# EAGLE design nolleblink2009_final (EAGLE 5.04)
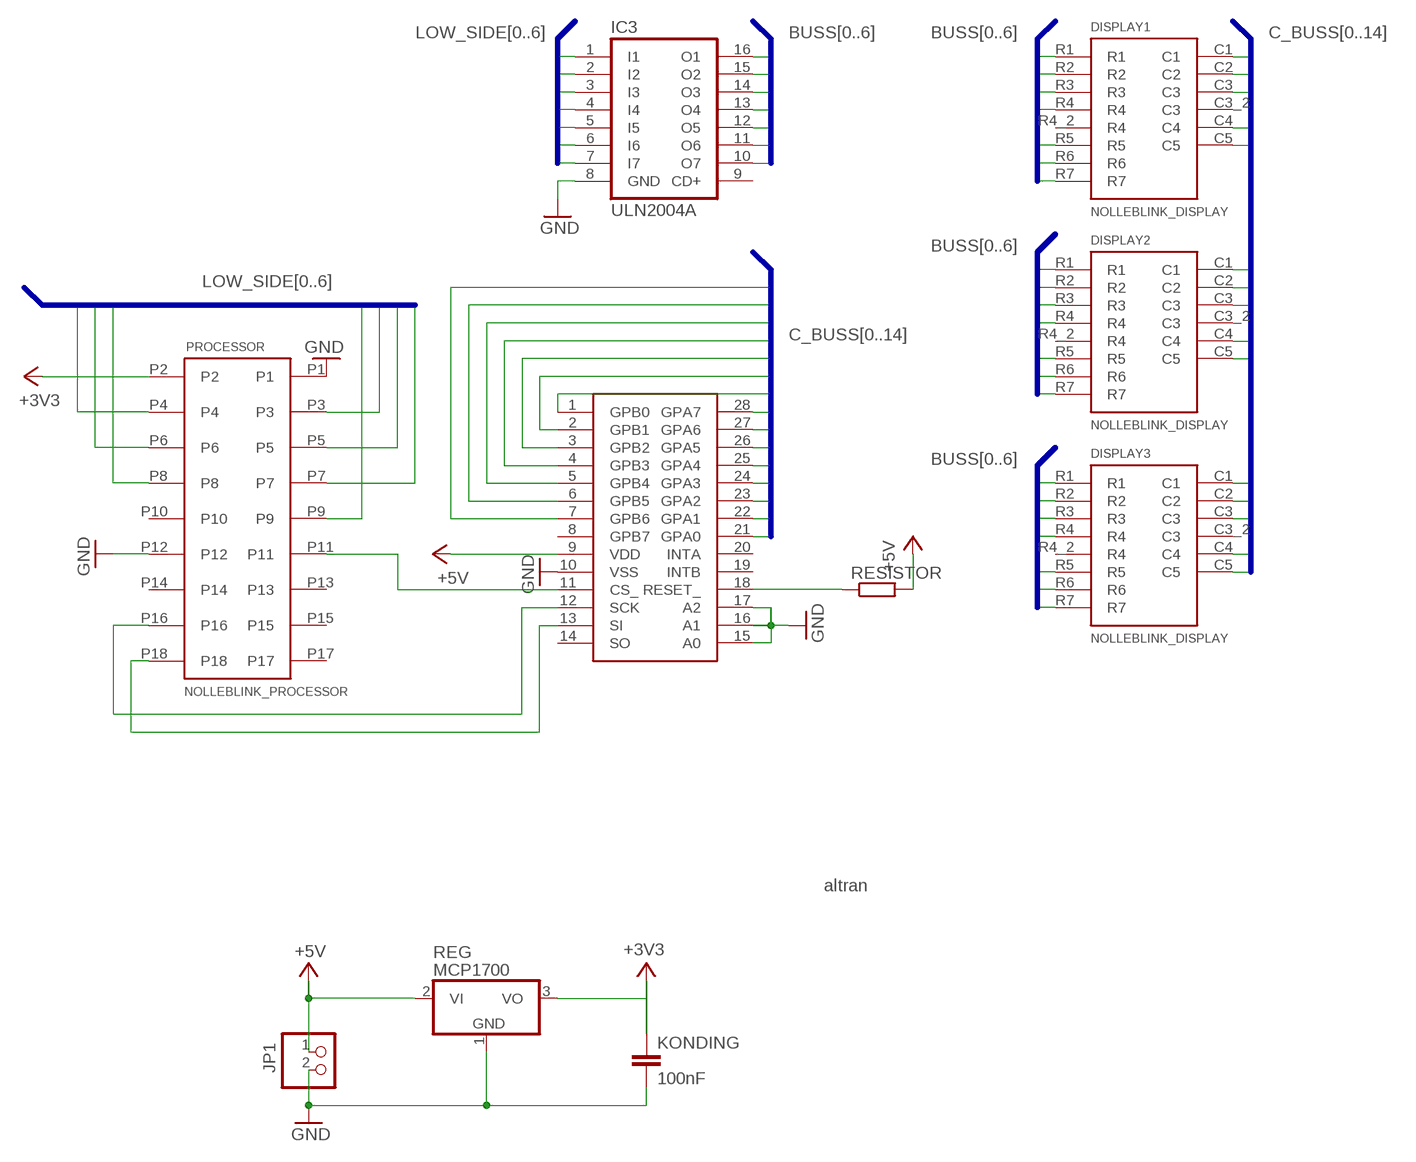
[diagram p0: schematic, sheet 1]

## Parts
DISPLAY1  NOLLEBLINK_DISPLAY  [KINGBRIGHT_TA12-11EWA]
DISPLAY2  NOLLEBLINK_DISPLAY  [KINGBRIGHT_TA12-11EWA]
DISPLAY3  NOLLEBLINK_DISPLAY  [KINGBRIGHT_TA12-11EWA]
IC2  MCPS23S17  [MCP23S17]
IC3  ULN2004A  ULN2004AN  [DIL16]
JP1  PINHD-1X2  [1X02]
KONDING  100nF  C-EU050-030X075  [C050-030X075]
PROCESSOR  NOLLEBLINK_PROCESSOR  [CON_18_NOLLEBLINK]
REG  MCP1700  MCP_REGULATOR  [TO92_REGULATOR]
RESISTOR  R-EU_0207/10  [0207/10]
U$1  ALTRAN  [ALTRAN]

## Nets
+3V3: KONDING.1 PROCESSOR.P2 REG.3(VO)
+5V: IC2.9(VDD) JP1.1 REG.2(VI) RESISTOR.2
BUSS0: DISPLAY1.R1 DISPLAY2.R1 DISPLAY3.R1 IC3.16(O1)
BUSS1: DISPLAY1.R2 DISPLAY2.R2 DISPLAY3.R2 IC3.15(O2)
BUSS2: DISPLAY1.R3 DISPLAY2.R3 DISPLAY3.R3 IC3.14(O3)
BUSS3: DISPLAY1.R4 DISPLAY2.R4 DISPLAY3.R4 IC3.13(O4)
BUSS4: DISPLAY1.R5 DISPLAY2.R5 DISPLAY3.R5 IC3.12(O5)
BUSS5: DISPLAY1.R6 DISPLAY2.R6 DISPLAY3.R6 IC3.11(O6)
BUSS6: DISPLAY1.R7 DISPLAY2.R7 DISPLAY3.R7 IC3.10(O7)
C_BUSS0: DISPLAY1.C1 IC2.21(GPA0)
C_BUSS1: DISPLAY1.C2 IC2.22(GPA1)
C_BUSS2: DISPLAY1.C3 IC2.23(GPA2)
C_BUSS3: DISPLAY1.C4 IC2.24(GPA3)
C_BUSS4: DISPLAY1.C5 IC2.25(GPA4)
C_BUSS5: DISPLAY2.C1 IC2.26(GPA5)
C_BUSS6: DISPLAY2.C2 IC2.27(GPA6)
C_BUSS7: DISPLAY2.C3 IC2.28(GPA7)
C_BUSS8: DISPLAY2.C4 IC2.1(GPB0)
C_BUSS9: DISPLAY2.C5 IC2.2(GPB1)
C_BUSS10: DISPLAY3.C1 IC2.3(GPB2)
C_BUSS11: DISPLAY3.C2 IC2.4(GPB3)
C_BUSS12: DISPLAY3.C3 IC2.5(GPB4)
C_BUSS13: DISPLAY3.C4 IC2.6(GPB5)
C_BUSS14: DISPLAY3.C5 IC2.7(GPB6)
GND: IC2.10(VSS) IC2.15(A0) IC2.16(A1) IC2.17(A2) IC3.8(GND) JP1.2 KONDING.2 PROCESSOR.P1 PROCESSOR.P12 REG.1(GND)
LOW_SIDE0: IC3.7(I7) PROCESSOR.P3
LOW_SIDE1: IC3.6(I6) PROCESSOR.P4
LOW_SIDE2: IC3.5(I5) PROCESSOR.P5
LOW_SIDE3: IC3.4(I4) PROCESSOR.P6
LOW_SIDE4: IC3.3(I3) PROCESSOR.P7
LOW_SIDE5: IC3.2(I2) PROCESSOR.P8
LOW_SIDE6: IC3.1(I1) PROCESSOR.P9
N$1: IC2.11(CS_) PROCESSOR.P11
N$2: IC2.13(SI) PROCESSOR.P18
N$3: IC2.12(SCK) PROCESSOR.P16
N$4: IC2.18(RESET_) RESISTOR.1
Unconnected: DISPLAY1.C3_2(C3) DISPLAY1.R4_2(R4) DISPLAY2.C3_2(C3) DISPLAY2.R4_2(R4) DISPLAY3.C3_2(C3) DISPLAY3.R4_2(R4) IC2.8(GPB7) IC2.14(SO) IC2.19(INTB) IC2.20(INTA) IC3.9(CD+) PROCESSOR.P10 PROCESSOR.P13 PROCESSOR.P14 PROCESSOR.P15 PROCESSOR.P17

## Buses
BUSS[0..6]
LOW_SIDE[0..6]
C_BUSS[0..14]

## Library data of the parts
DISPLAY1-DISPLAY3 = stefan:NOLLEBLINK_DISPLAY: Nolleblinkmojt Display 2009 www.etf.nu
IC2 = microchip2:MCPS23S17
IC3 = uln-udn:ULN2004A: DRIVER ARRAY
JP1 = pinhead:PINHD-1X2: PIN HEADER
KONDING = rcl:C-EU: CAPACITOR, European symbol
PROCESSOR = stefan:NOLLEBLINK_PROCESSOR: Texas Instruments Development Board Nolleblinkmojt 2009 www.etf.nu
REG = ag:MCP_REGULATOR
RESISTOR = rcl:R-EU_: RESISTOR, European symbol
U$1 = mine:ALTRAN

## Board
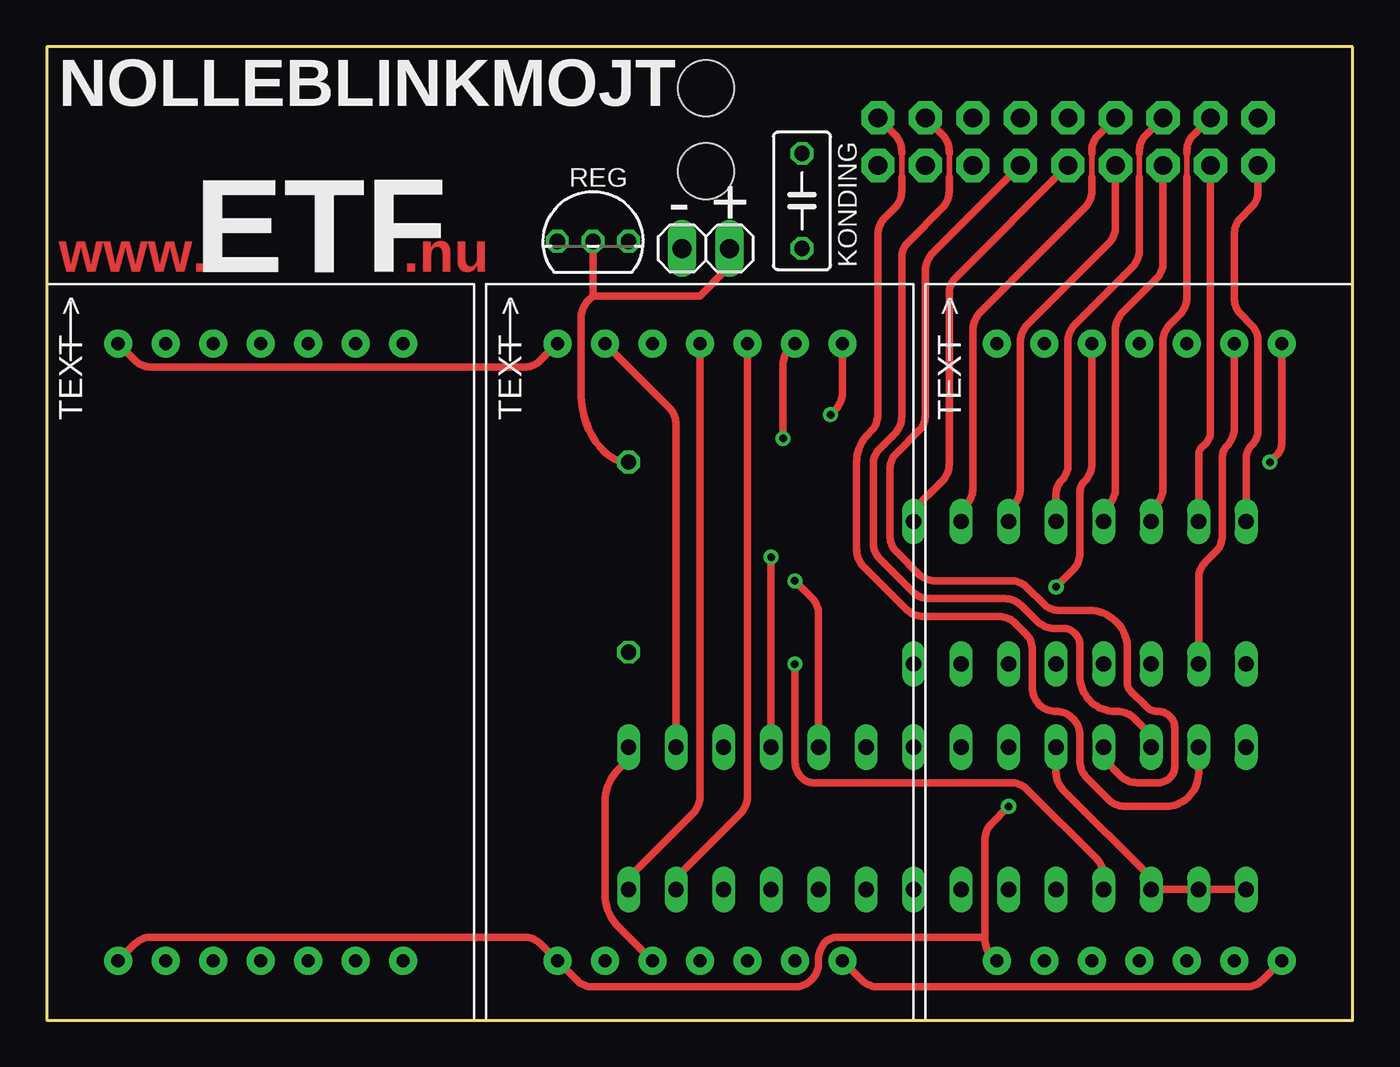
[diagram p1: board, top side]
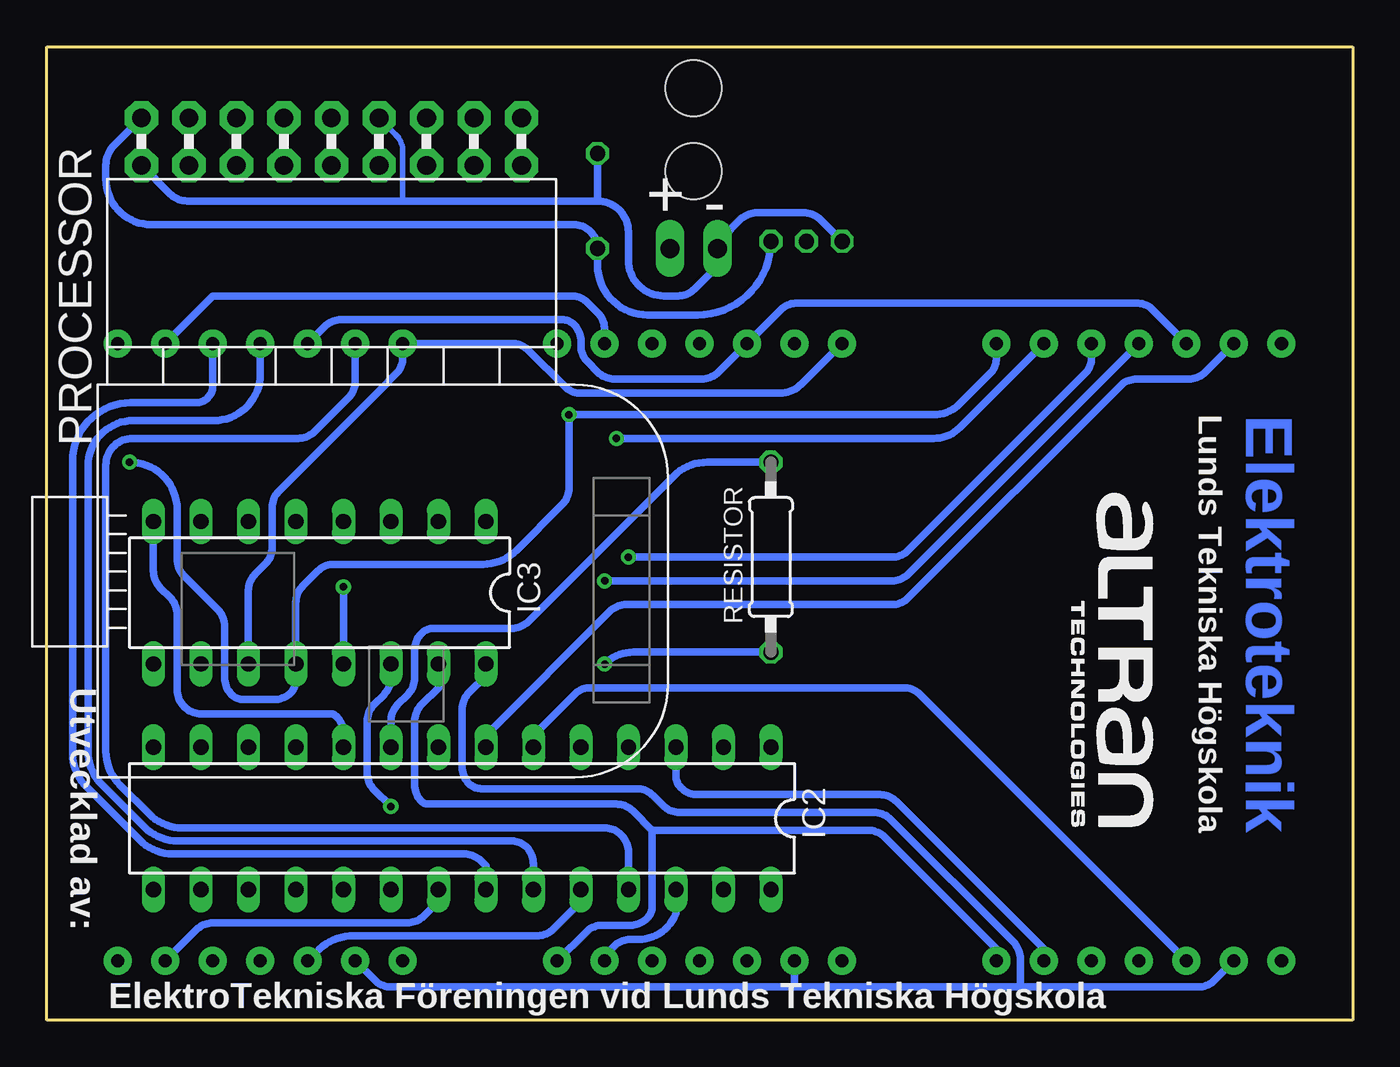
[diagram p2: board, bottom side, seen from below]

Size 69.84 x 52.06 mm. Coordinates in mm from the lower left corner, seen from the top.
Outline: 0,0 69.84,0 69.84,52.06 0,52.06 0,0
Copper layers (1*16): Top 0.0356mm / dielectric 1.5mm / Bottom 0.0356mm
Design rules "pcb_cart_standard (by skoog)": minimum track width 0.2007mm, minimum drill 0.0102mm, track to track 0.2007mm, track to pad 0.2007mm, pad to pad 0.2007mm, via to via 0.2007mm, smd to smd 16mil, copper to edge 0.2007mm, drill to drill 0.2007mm, minimum pad ring 0.2007mm, minimum via ring 8mil, stop-mask expansion 0mil, vias tented up to drill 0mil, thermal gap 0.2007mm
Holes 3 mm at 35.24,49.85 35.24,45.4

### Footprints (pad centres in the part's own frame; a part is rotated, then mirrored left to right if it is on the bottom)
KINGBRIGHT_TA12-11EWA = drill 0.7 pad 1.5 round: C1 5.08,-16.51; C2 2.54,16.51; C3 0,16.51; C3_2 0,-16.51; C4 -2.54,-16.51; C5 -5.08,16.51; R1 -5.08,-16.51; R2 7.62,-16.51; R3 -7.62,-16.51; R4 -2.54,16.51; R4_2 2.54,-16.51; R5 7.62,16.51; R6 -7.62,16.51; R7 5.08,16.51
MCP23S17 = drill 0.813 long: 1 -12.7,-3.81; 2 -10.16,-3.81; 3 -7.62,-3.81; 4 -5.08,-3.81; 5 -2.54,-3.81; 6 0,-3.81; 7 2.54,-3.81; 8 5.08,-3.81; 9 7.62,-3.81; 10 10.16,-3.81; 11 12.7,-3.81; 12 15.24,-3.81; 13 17.78,-3.81; 14 20.32,-3.81; 15 20.32,3.81; 16 17.78,3.81; 17 15.24,3.81; 18 12.7,3.81; 19 10.16,3.81; 20 7.62,3.81; 21 5.08,3.81; 22 2.54,3.81; 23 0,3.81; 24 -2.54,3.81; 25 -5.08,3.81; 26 -7.62,3.81; 27 -10.16,3.81; 28 -12.7,3.81
DIL16 = drill 0.813 long: 1 -8.89,-3.81; 2 -6.35,-3.81; 3 -3.81,-3.81; 4 -1.27,-3.81; 5 1.27,-3.81; 6 3.81,-3.81; 7 6.35,-3.81; 8 8.89,-3.81; 9 8.89,3.81; 10 6.35,3.81; 11 3.81,3.81; 12 1.27,3.81; 13 -1.27,3.81; 14 -3.81,3.81; 15 -6.35,3.81; 16 -8.89,3.81
1X02 = drill 1.016 long: 1 -1.27,0; 2 1.27,0
C050-030X075 = drill 0.813 octagon: 1 -2.54,0; 2 2.54,0
CON_18_NOLLEBLINK = drill 1 pad 1.778 octagon: P1 10.16,1.27; P2 10.16,-1.27; P3 7.62,1.27; P4 7.62,-1.27; P5 5.08,1.27; P6 5.08,-1.27; P7 2.54,1.27; P8 2.54,-1.27; P9 0,1.27; P10 0,-1.27; P11 -2.54,1.27; P12 -2.54,-1.27; P13 -5.08,1.27; P14 -5.08,-1.27; P15 -7.62,1.27; P16 -7.62,-1.27; P17 -10.16,1.27; P18 -10.16,-1.27
TO92_REGULATOR = drill 0.813 octagon: 1 -1.905,0; 2 0,0; 3 1.905,0
0207/10 = drill 0.813 octagon: 1 -5.08,0; 2 5.08,0

### Placement (x,y rotation side)
DISPLAY1  58.42,19.68 0 top
DISPLAY2  34.92,19.68 0 top
DISPLAY3  11.43,19.68 0 top
IC2  43.81,10.79 180 bottom
IC3  55.24,22.86 180 bottom
JP1  35.24,41.27 180 top
KONDING  40.39,43.81 90 top
PROCESSOR  54.61,46.99 180 bottom
REG  29.21,41.66 0 top
RESISTOR  31.11,24.77 90 bottom
U$1  17.97,6.97 90 top

### Tracks (layer width: path | path; a pad name or v marks a point on that pad's centre or on a via)
+3V3
  Bottom 0.305: 65.4,47.63 PROCESSOR.P2 | 64.14,42.55 64.24,42.55
  Bottom 0.406: REG.3 arc90 35.05,37.72 37.71,37.72 arc90 40.39,40.39 KONDING.1 arc-90 41.66,42.55 64.14,42.55 | 64.24,42.55 arc90 66.67,44.98 66.67,45.72 arc45 66.23,46.8 65.4,47.63
+5V
  Top 0.406: 34.92,38.73 36.2,40.01 36.2,40.96 JP1.1 36.51,40.32 34.92,38.73 | 29.21,38.73 34.92,38.73 | 29.21,38.73 REG.2 | 29.21,38.73 28.95,38.47 arc45 28.57,37.57 28.57,33.44 arc45 29.84,30.37 arc45 RESISTOR.2
  Bottom 0.406: IC2.9 51.44,15.98 arc45 51.06,16.88 50.54,17.41 arc-45 50.16,18.31 50.16,19.79 arc45 49.79,20.69 arc45 49.16,20.95 44.98,20.95 arc-45 44.08,21.33 36.3,29.1 arc45 34.51,29.84 RESISTOR.2
BUSS0
  Bottom 0.406: IC3.16 46.35,18.41 47.25,17.52 arc-45 47.62,16.62 47.62,13.54 arc-45 47.25,12.65 arc-45 46.62,12.38 38.31,12.38 arc45 37.41,12.01 36.88,11.48 arc-45 35.99,11.11 25.61,11.11 arc45 24.71,10.74 18.15,4.18 arc45 17.78,3.28 17.78,1.78 | 17.78,1.78 29.84,1.78 | 29.84,1.78 DISPLAY2.R1 | 29.84,1.78 51.42,1.78 arc45 52.31,2.15 DISPLAY1.R1 | 17.78,1.78 8.27,1.78 arc-45 7.38,2.15 DISPLAY3.R1
BUSS1
  Top 0.406: DISPLAY2.R2 43.57,2.15 arc45 44.47,1.78 64.12,1.78 arc45 65.02,2.15 DISPLAY1.R2
  Bottom 0.406: IC3.15 48.9,17.78 49.79,16.88 arc-45 50.16,15.98 50.16,12.59 arc-45 49.79,11.69 arc-45 49.47,11.56 39.39,11.56 arc45 38.49,11.19 37.47,10.16 | 37.47,10.16 37.47,6.09 arc45 37.73,5.45 arc45 38.63,5.08 40.11,5.08 arc-45 41.01,4.71 DISPLAY2.R2 | DISPLAY3.R2 19.05,3.81 25.03,9.79 arc-45 25.93,10.16 37.47,10.16
BUSS2  (via drill 0.4)
  Top 0.406: 50.16,4.45 50.16,9.63 arc-45 50.54,10.53 v51.44,11.43 | 50.16,4.45 50.16,4.34 arc45 50.54,3.44 DISPLAY1.R3 | DISPLAY3.R3 4.71,4.07 arc-45 5.61,4.45 25.51,4.45 arc-45 26.41,4.07 DISPLAY2.R3 28.33,2.15 arc45 29.23,1.78 39.99,1.78 arc45 40.88,2.15 40.9,2.17 arc45 41.27,3.07 41.27,3.28 arc-45 41.65,4.18 arc-45 42.28,4.45 50.16,4.45
  Bottom 0.406: v51.44,11.43 52.33,12.33 arc45 52.7,13.23 52.7,15.98 arc45 52.33,16.88 51.81,17.41 arc-45 51.44,18.31 IC3.14
BUSS3  (via drill 0.4)
  Top 0.406: v53.98,23.18 54.87,24.08 arc45 55.24,24.97 55.24,28.2 arc-45 55.51,28.84 arc45 55.88,29.74 DISPLAY1.R4
  Bottom 0.406: v53.98,23.18 IC3.13 | DISPLAY3.R4 10.68,37.98 arc-45 11.57,38.35 29.7,38.35 arc-45 30.6,37.98 DISPLAY2.R4 33.92,34.66 arc45 34.82,34.29 39.48,34.29 arc45 40.38,34.66 40.9,35.19 arc45 41.27,36.09 41.27,36.3 arc-45 41.65,37.2 arc-45 42.28,37.47 54.08,37.47 arc-45 54.98,37.09 DISPLAY1.R4
BUSS4  (via drill 0.4)
  Top 0.406: v65.41,29.84 65.78,30.22 arc45 66.04,30.85 DISPLAY1.R5 | v41.91,32.38 42.17,32.65 arc45 42.55,33.55 DISPLAY2.R5
  Bottom 0.406: DISPLAY3.R5 19.05,35.45 arc45 19.42,34.55 21,32.97 arc45 22.42,32.38 v41.91,32.38 41.91,28.47 arc45 42.28,27.57 44.72,25.13 arc45 46.52,24.38 54.47,24.38 arc-45 55.36,24.01 56.14,23.23 arc-45 56.52,22.33 IC3.12 56.52,18.15 arc45 56.78,17.52 arc45 57.68,17.14 59.32,17.14 arc45 59.95,17.41 arc45 60.33,18.31 60.33,21.06 arc-45 60.7,21.96 62.49,23.76 arc45 62.87,24.66 62.87,27.3 arc-90 v65.41,29.84
BUSS5
  Top 0.406: DISPLAY3.R6 4.71,35.3 arc45 5.61,34.92 25.51,34.92 arc45 26.41,35.3 DISPLAY2.R6
  Bottom 0.406: IC3.11 59.05,22.97 arc45 58.68,23.87 58.16,24.39 arc-45 57.78,25.29 57.78,27.41 arc45 57.41,28.31 52.07,33.66 51.17,34.55 arc-45 50.8,35.45 DISPLAY1.R6 44.98,36.2 arc45 44.08,35.82 42.16,33.9 arc-45 41.26,33.53 30.62,33.53 arc-45 29.47,34.03 DISPLAY2.R6
BUSS6  (via drill 0.4)
  Top 0.406: DISPLAY1.R7 63.5,31.64 arc-45 63.13,30.74 arc45 62.87,30.11 62.87,25.93 arc-45 62.49,25.03 61.97,24.5 arc45 61.59,23.6 IC3.10 | v39.37,31.11 39.37,35.03 arc-45 39.74,35.93 DISPLAY2.R7
  Bottom 0.406: DISPLAY1.R7 60.96,38.73 41.8,38.73 arc45 40.9,38.36 40.38,37.84 arc45 40.01,36.94 DISPLAY2.R7 | DISPLAY3.R7 21,31.7 arc45 22.42,31.11 v39.37,31.11
C_BUSS0
  Bottom 0.406: IC2.21 48.9,6.35 49.67,5.58 arc45 50.56,5.21 60.94,5.21 arc-45 61.84,4.83 DISPLAY1.C1
C_BUSS1
  Bottom 0.406: IC2.22 46.35,8.26 46.62,8.52 arc-45 47.52,8.89 63.08,8.89 arc45 64.88,9.63 67.71,12.46 arc45 68.45,14.26 68.45,29.92 arc90 65.35,33.02 61.86,33.02 arc-90 60.96,33.92 DISPLAY1.C2
C_BUSS2
  Bottom 0.406: IC2.23 43.81,8.36 arc-45 44.19,9.26 arc-45 44.98,9.59 62.83,9.59 arc45 64.62,10.33 66.88,12.59 arc45 67.63,14.39 67.63,29.65 arc90 65.21,32.07 60.9,32.07 arc-90 58.42,34.55 DISPLAY1.C3
C_BUSS3
  Bottom 0.406: IC2.24 41.27,6.35 42.74,4.88 arc45 43.64,4.51 53.62,4.51 arc-45 55.42,3.64 DISPLAY1.C4
C_BUSS4
  Bottom 0.406: IC2.25 38.73,9 arc-45 39.11,9.9 39.12,9.91 arc-45 40.02,10.29 62.58,10.29 arc45 64.37,11.03 65.93,12.59 arc45 66.67,14.39 66.67,29.7 arc90 65.25,31.11 56.41,31.11 arc-45 55.51,31.49 53.71,33.28 arc-45 53.34,34.18 DISPLAY1.C5
C_BUSS5
  Bottom 0.406: IC2.26 36.2,5.71 36.22,5.65 arc68 38.21,4.32 38.6,4.32 arc-61 39.74,3.65 DISPLAY2.C1
C_BUSS6
  Top 0.406: IC2.27 33.66,7.62 37.09,11.06 arc45 37.47,11.96 DISPLAY2.C2
C_BUSS7
  Top 0.406: IC2.28 31.11,7.62 34.55,11.06 arc45 34.92,11.96 DISPLAY2.C3
C_BUSS8
  Top 0.406: DISPLAY2.C4 30.59,4.97 arc-45 29.84,6.77 29.84,11.65 arc-45 30.59,13.44 31.11,13.97 IC2.1
C_BUSS9
  Top 0.406: IC2.2 33.66,31.86 arc45 33.28,32.76 DISPLAY2.C5
C_BUSS10
  Bottom 0.406: IC2.3 36.2,13.07 arc-45 35.93,12.44 arc-45 35.03,12.06 25.29,12.06 arc45 24.39,11.69 16.51,3.81 DISPLAY3.C1
C_BUSS11  (via drill 0.4)
  Top 0.406: v38.73,24.77 IC2.4
  Bottom 0.406: DISPLAY3.C2 13.97,35.45 arc45 14.34,34.55 23.76,25.14 arc45 24.66,24.77 v38.73,24.77
C_BUSS12  (via drill 0.4)
  Top 0.406: v40.01,23.5 40.9,22.6 arc-45 41.27,21.7 IC2.5
  Bottom 0.406: DISPLAY3.C3 23.76,23.87 arc45 24.66,23.5 v40.01,23.5
C_BUSS13
  Bottom 0.406: IC2.6 43.81,15.24 41.65,17.41 arc45 40.75,17.78 24.02,17.78 arc45 23.12,17.41 DISPLAY3.C4
C_BUSS14
  Bottom 0.406: IC2.7 46.35,15.24 39.74,21.85 arc45 38.84,22.23 24.66,22.23 arc-45 23.76,22.6 12.44,33.92 arc45 11.54,34.29 8.78,34.29 arc-45 7.88,34.66 DISPLAY3.C5
GND
  Top 0.406: IC3.8 64.14,29.95 arc-45 64.51,30.85 arc45 64.77,31.49 64.77,36.3 arc45 64.4,37.2 63.87,37.73 arc-45 63.5,38.63 63.5,42.02 arc-45 63.87,42.92 64.4,43.44 arc45 64.77,44.34 PROCESSOR.P1 | IC2.15 IC2.16 IC2.17 59.05,7.62 54.35,12.33 arc-45 53.98,13.23 IC2.10
  Bottom 0.305: 50.8,43.81 50.8,46.46 arc-45 51.17,47.36 PROCESSOR.P12
  Bottom 0.406: IC2.10 53.98,15.35 arc-45 54.35,16.25 arc-45 54.67,16.38 61.58,16.38 arc45 62.48,16.75 62.49,16.77 arc45 62.87,17.67 62.87,21.7 arc-45 63.24,22.6 63.76,23.12 arc45 64.14,24.02 IC3.8 | PROCESSOR.P1 63.24,44.19 arc-45 62.34,43.81 50.8,43.81 40.39,43.81 | 27,41.53 arc45 REG.1 28.44,42.79 arc-45 29.38,43.18 31.86,43.18 arc-45 32.76,42.81 33.66,41.91 33.66,41.59 JP1.2 33.97,40.32 35.19,39.11 arc45 36.09,38.73 36.83,38.73 arc90 38.73,40.64 38.73,42.16 arc-90 40.39,43.81 | 40.39,43.81 KONDING.2
LOW_SIDE0
  Top 0.406: IC3.7 61.59,30.22 arc-45 61.78,30.67 61.79,30.68 arc45 62.23,31.38 PROCESSOR.P3
LOW_SIDE1
  Top 0.305: 60.96,45.09 60.96,46.35
  Top 0.406: IC3.6 59.05,27.3 59.32,27.57 arc45 59.69,28.47 59.69,36.3 arc-45 60.06,37.2 60.59,37.73 arc45 60.96,38.63 60.96,45.09 | 60.96,46.35 60.96,46.46 arc-45 61.33,47.36 PROCESSOR.P4
LOW_SIDE2
  Top 0.406: IC3.5 56.52,27.3 56.78,27.57 arc45 57.15,28.47 57.15,36.94 arc-45 57.52,37.84 59.32,39.63 arc45 59.69,40.53 PROCESSOR.P5
LOW_SIDE3
  Top 0.305: 58.42,45.09 58.42,46.35
  Top 0.406: IC3.4 53.98,28.2 arc-45 54.24,28.84 arc45 54.61,29.74 54.61,36.3 arc-45 54.98,37.2 58.05,40.27 arc45 58.42,41.17 58.42,45.09 | PROCESSOR.P6 58.79,47.36 arc45 58.42,46.46 58.42,46.35
LOW_SIDE4
  Top 0.406: IC3.3 51.44,27.3 51.7,27.57 arc45 52.07,28.47 52.07,36.3 arc-45 52.44,37.2 56.78,41.54 arc45 57.15,42.44 PROCESSOR.P7
LOW_SIDE5
  Top 0.305: 55.88,45.09 55.88,46.35
  Top 0.406: IC3.2 48.9,27.3 49.16,27.57 arc45 49.53,28.47 49.53,36.94 arc-45 49.9,37.84 55.51,43.44 arc45 55.88,44.34 55.88,45.09 | 55.88,46.35 55.88,46.46 arc-45 56.25,47.36 PROCESSOR.P8
LOW_SIDE6
  Top 0.406: IC3.1 46.35,27.3 47.89,28.84 arc45 48.26,29.74 48.26,38.84 arc-45 48.63,39.74 PROCESSOR.P9
N$1
  Top 0.406: IC2.11 56.52,13.97 57.41,13.07 arc45 58.31,12.7 59.43,12.7 arc90 60.33,13.6 60.33,15.61 arc90 59.43,16.51 arc-45 58.79,16.77 57.97,17.59 arc-45 57.78,18.04 57.78,19.88 arc90 55.75,21.91 54.18,21.91 arc-45 53.28,22.28 52.44,23.12 arc45 51.54,23.5 47.52,23.5 arc-45 46.62,23.87 45.46,25.03 arc-45 45.09,25.93 45.09,29.45 arc-45 45.46,30.34 46.62,31.5 arc45 46.99,32.4 46.99,40.11 arc-45 47.36,41.01 PROCESSOR.P11
N$2
  Top 0.305: 45.72,45.09 45.72,46.35
  Top 0.406: PROCESSOR.P18 45.35,47.36 arc-45 45.72,46.46 45.72,46.35 | 45.72,45.09 45.72,44.34 arc-45 45.35,43.44 44.82,42.92 arc45 44.45,42.02 44.45,32.4 arc-45 44.08,31.5 43.93,31.36 arc45 43.31,29.83 43.31,25.16 arc45 43.68,24.27 45.98,21.96 arc45 46.88,21.59 50.91,21.59 arc-45 51.81,21.22 52.33,20.69 arc-45 52.7,19.79 52.7,17.78 arc90 53.98,16.51 arc-90 55.24,15.24 55.24,13.86 arc45 55.62,12.96 56.78,11.8 arc45 57.68,11.43 59.8,11.43 arc90 61.59,13.23 IC2.13
N$3
  Top 0.305: 48.26,45.09 48.26,46.35
  Top 0.406: IC2.12 59.05,15.24 58.16,16.14 arc45 57.26,16.51 57.15,16.51 | 57.15,16.51 57.04,16.51 | PROCESSOR.P16 47.89,47.36 arc-45 48.26,46.46 48.26,46.35 | 48.26,45.09 48.26,44.34 arc-45 47.89,43.44 46.09,41.65 arc45 45.72,40.75 45.72,32.28 arc-45 45.35,31.38 44.57,30.6 arc45 44.2,29.7 44.2,25.55 arc45 44.57,24.65 46.3,22.91 arc45 47.2,22.54 51.23,22.54 arc-45 52.12,22.17 52.97,21.33 arc45 53.87,20.95 54.35,20.95 arc-90 55.24,20.06 55.24,18.41 arc90 57.15,16.51
N$4  (via drill 0.4)
  Top 0.406: IC2.18 56.52,7.73 arc45 56.14,8.63 52.44,12.33 arc45 51.54,12.7 41.01,12.7 arc-45 40.38,12.96 arc-45 40.01,13.86 v40.01,19.05
  Bottom 0.406: v40.01,19.05 arc45 38.47,19.68 RESISTOR.1

### Text on the board
Top: www. | .nu
Bottom: Elektroteknik
tPlace: ETF
tNames: NOLLEBLINKMOJT | - | +
bNames: - | + | Lunds Tekniska Högskola | Utvecklad av: | ElektroTekniska Föreningen vid Lunds Tekniska Högskola
bStop: Elektroteknik
Document: FEL. TVÄRTOM ---> | --> | Halv millimeter för mycket?